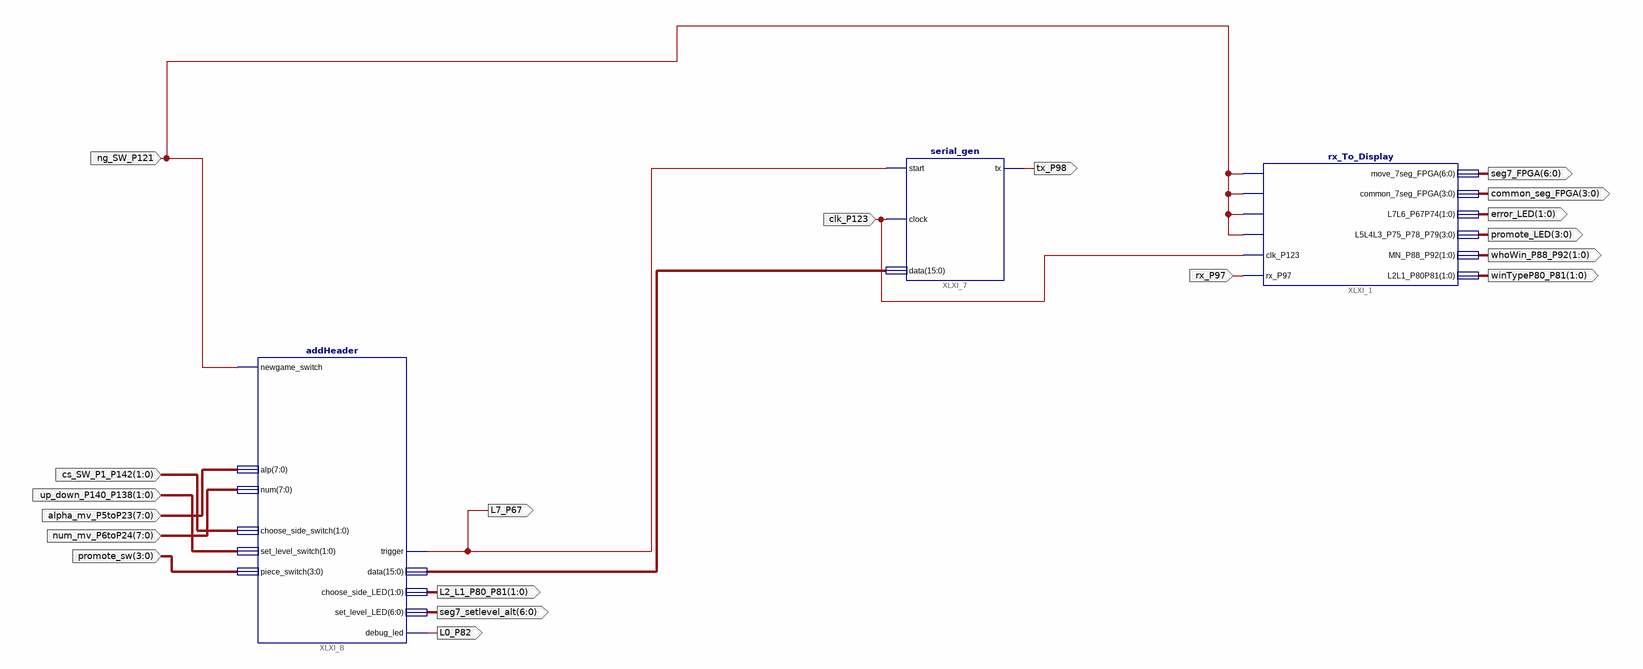
[diagram p0: schematic sheet 1]
// Xilinx ISE schematic main.sch (spartan6) as structural Verilog: 3 symbols, 19 ports
module main (
  input  clk_P123,
  input  rx_P97,
  input  ng_SW_P121,
  input  [1:0] cs_SW_P1_P142,
  input  [1:0] up_down_P140_P138,
  input  [7:0] alpha_mv_P5toP23,
  input  [7:0] num_mv_P6toP24,
  input  [3:0] promote_sw,
  output tx_P98,
  output [6:0] seg7_FPGA,
  output [3:0] common_seg_FPGA,
  output [1:0] error_LED,
  output [3:0] promote_LED,
  output [1:0] whoWin_P88_P92,
  output [1:0] winTypeP80_P81,
  output L7_P67,
  output [1:0] L2_L1_P80_P81,
  output [6:0] seg7_setlevel_alt,
  output L0_P82
);

  wire [15:0] XLXN_44;

  rx_To_Display XLXI_1 (
    .clk_P123(clk_P123), .common_7seg_FPGA(common_seg_FPGA), .L2L1_P80P81(winTypeP80_P81),
    .L5L4L3_P75_P78_P79(promote_LED), .L7L6_P67P74(error_LED), .MN_P88_P92(whoWin_P88_P92),
    .move_7seg_FPGA(seg7_FPGA), .rx_clear_endgame(ng_SW_P121), .rx_clear_error(ng_SW_P121),
    .rx_clear_move(ng_SW_P121), .rx_clear_promote(ng_SW_P121), .rx_P97(rx_P97));
  serial_gen XLXI_7 (.start(L7_P67), .clock(clk_P123), .data(XLXN_44), .tx(tx_P98));
  addHeader XLXI_8 (
    .newgame_switch(ng_SW_P121), .choose_side_switch(cs_SW_P1_P142), .set_level_switch(up_down_P140_P138),
    .alp(alpha_mv_P5toP23), .num(num_mv_P6toP24), .piece_switch(promote_sw), .debug_led(L0_P82),
    .trigger(L7_P67), .data(XLXN_44), .choose_side_LED(L2_L1_P80_P81), .set_level_LED(seg7_setlevel_alt));
endmodule
